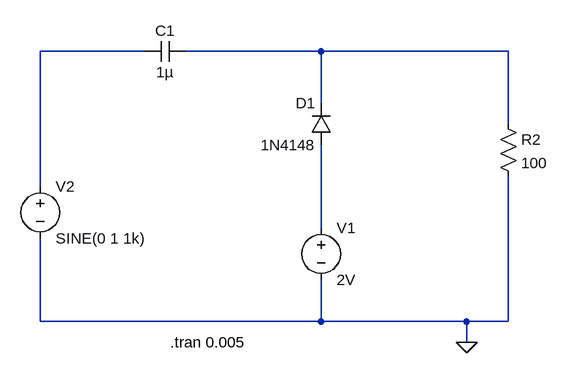
[diagram p0: schematic Clipper and clamper.asc]
Clipper and clamper.asc, the LTspice schematic file:
Version 4
SHEET 1 880 680
WIRE 96 96 -64 96
WIRE 368 96 160 96
WIRE 656 96 368 96
WIRE 368 176 368 96
WIRE 656 208 656 96
WIRE -64 304 -64 96
WIRE 368 368 368 240
WIRE -64 512 -64 384
WIRE 368 512 368 448
WIRE 368 512 -64 512
WIRE 592 512 368 512
WIRE 656 512 656 288
WIRE 656 512 592 512
WIRE 592 544 592 512
FLAG 592 544 0
SYMBOL diode 384 240 R180
WINDOW 0 24 64 Left 2
WINDOW 3 24 0 Left 2
SYMATTR InstName D1
SYMATTR Value 1N4148
SYMBOL voltage 368 352 R0
WINDOW 123 0 0 Left 0
WINDOW 39 0 0 Left 0
SYMATTR InstName V1
SYMATTR Value 2V
SYMBOL voltage -64 288 R0
WINDOW 123 0 0 Left 0
WINDOW 39 0 0 Left 0
SYMATTR InstName V2
SYMATTR Value SINE(0 1 1k)
SYMBOL res 640 192 R0
SYMATTR InstName R2
SYMATTR Value 100
SYMBOL cap 160 80 R90
WINDOW 0 0 32 VBottom 2
WINDOW 3 32 32 VTop 2
SYMATTR InstName C1
SYMATTR Value 1µ
TEXT 136 544 Left 2 !.tran 0.005

The netlist it stands for:
* Clipper and clamper.asc
D1 N003 N002 1N4148
V1 N003 0 2V
V2 N001 0 SINE(0 1 1k)
R2 N002 0 100
C1 N002 N001 1µ
.model D D
.lib standard.dio
.tran 0.005
.backanno
.end